# Altium schematic sheet 5VSupply_3.5A.SchDoc
size A; SheetNumber: 2; SheetTotal: 3
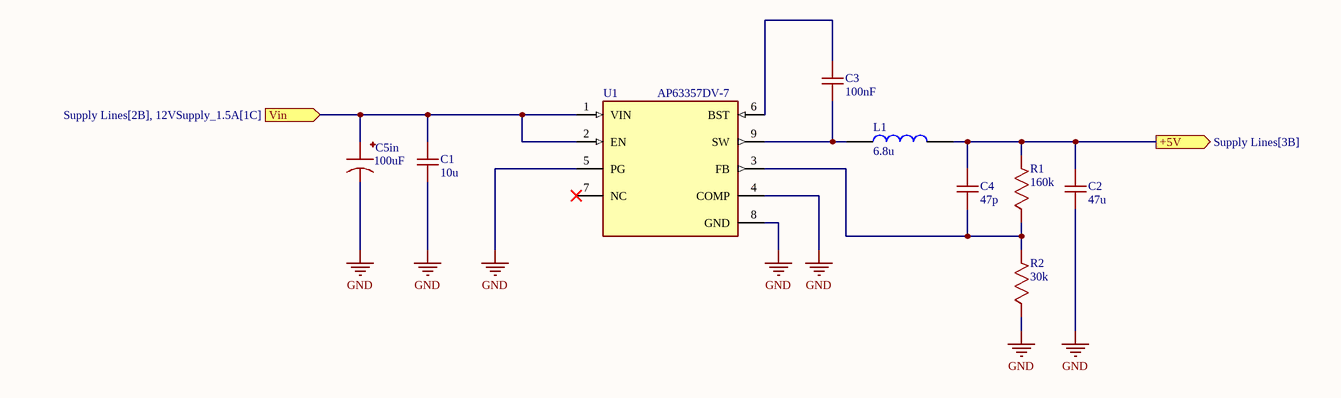
[diagram p0: 5VSupply_3.5A.SchDoc]

## Parts
C1  10u  [FP-GRM21B-0_15-IPC_A]
C2  47u  [FP-GRM21B-0_15-IPC_A]
C3  100nF  [CAPC2013X140X45ML15T25]
C4  47p  [(KEMET 0805) FP-C0805C-DN-IPC_A - duplicate]
C5in  100uF  [CAPPRD350W60D800H1150]
L1  6.8u  [INDPM7366X300N]
R1  160k  [RESC2013X60X40LL20T25]
R2  30k  [FP-CRGCQ0805-IPC_A - duplicate]
U1  AP63357DV-7  [CONV_AP63357DV-7]

## Ports
+5V (out, see Supply Lines[3B]), Vin (in, see Supply Lines[2B], 12VSupply_1.5A[1C])

## Nets
GND: C1.1 C2.1 C5in.2 R2.1 U1.4(COMP) U1.5(PG) U1.8(GND)
+5V: C2.2 C4.2 L1.2 R1.2 ; port +5V
Vin: C1.2 C5in.1 U1.1(VIN) U1.2(EN) ; port Vin
NetC3_1: C3.1 L1.1 U1.9(SW)
NetC3_2: C3.2 U1.6(BST)
NetC4_1: C4.1 R1.1 R2.2 U1.3(FB)

Not connected (* = marked no-connect by the designer): U1 7(NC)*

## Library data of the parts
C1 = GRM21BC81E106KE51L: Ceramic Capacitor, Ceramic, 25V, 10% +Tol, 10% -Tol, X6S, 22% TC, 10uF, Surface Mount, 0805; Manufacturer: Murata; Manufacturer Lifecycle Status: IN PRODUCTION; Value: 10µF; Supplier: DigiKey; Supplier Part Number: 490-10502-1-ND; Manufacturer Part Number: GRM21BC81E106KE51L; RoHS: Compliant; Category: Ceramic Capacitors; Stock: 699194; Pricing: 1=0.23, 10=0.133, 50=0.0956, 100=0.0841, 500=0.06476, 1000=0.05881 (USD); Case/Package: 0805; Case Code (Imperial): 0805; Case Code (Metric): 2012; Dielectric: X6S; Dielectric Material: Ceramic; Height: 1.25mm; Length: 2mm; Lifecycle Status: Production; Material: Ceramic; Max Operating Temperature: 105°C; Min Operating Temperature: -55°C; Mounting Technology: Surface Mount; Number of Terminals: 2; REACH SVHC: Yes; Schedule B: 8532240020, 8532240020|8532240020|8532240020|8532240020|8532240020|8532240020|8532240020|8532240020|8532240020|8532240020|8532240020|8532240020|8532240020|8532240020|8532240020|8532240020|8532240020|8532240020|8532240020|8532240020|8532240020|8532240020|8532240020|85; Thickness: 1.25mm; Tolerance: 10%; Voltage Rating: 25V; Voltage Rating (DC): 25V; Width: 1.25mm; ComponentLink1URL: https://datasheet.octopart.com:443/GRM21BC81E106KE51L-Murata-datasheet-155239200.pdf?src-supplier=Newark; ComponentLink1Description: https://datasheet.octopart.com:443/GRM21BC81E106KE51L-Murata-datasheet-155239200.pdf?src-supplier=Newark; ComponentLink2URL: https://datasheet.octopart.com:443/GRM21BC81E106KE51L-Murata-datasheet-178521784.pdf?src-supplier=Arrow.cn; ComponentLink2Description: https://datasheet.octopart.com:443/GRM21BC81E106KE51L-Murata-datasheet-178521784.pdf?src-supplier=Arrow.cn; ComponentLink3URL: https://datasheet.octopart.com:443/GRM21BC81E106KE51L-Murata-datasheet-165579666.pdf?src-supplier=TME; ComponentLink3Description: https://datasheet.octopart.com:443/GRM21BC81E106KE51L-Murata-datasheet-165579666.pdf?src-supplier=TME; ComponentLink4URL: https://datasheet.octopart.com:443/GRM21BC81E106KE51L-Murata-datasheet-140707432.pdf?src-supplier=Ciiva; ComponentLink4Description: https://datasheet.octopart.com:443/GRM21BC81E106KE51L-Murata-datasheet-140707432.pdf?src-supplier=Ciiva; ComponentLink5URL: https://datasheet.octopart.com:443/GRM21BC81E106KE51L-Murata-datasheet-140706587.pdf?src-supplier=Ciiva; ComponentLink5Description: https://datasheet.octopart.com:443/GRM21BC81E106KE51L-Murata-datasheet-140706587.pdf?src-supplier=Ciiva; ComponentLink6URL: https://datasheet.octopart.com:443/GRM21BC81E106KE51L-Murata-datasheet-138744753.pdf?src-supplier=Ciiva; ComponentLink6Description: https://datasheet.octopart.com:443/GRM21BC81E106KE51L-Murata-datasheet-138744753.pdf?src-supplier=Ciiva; ComponentLink7URL: https://datasheet.octopart.com:443/GRM21BC81E106KE51L-Murata-datasheet-32479577.pdf?src-supplier=Future+Electronics; ComponentLink7Description: https://datasheet.octopart.com:443/GRM21BC81E106KE51L-Murata-datasheet-32479577.pdf?src-supplier=Future+Electronics; ComponentLink8URL: https://datasheet.octopart.com/GRM21BC81E106KE51L-Murata-datasheet-12515295.pdf; ComponentLink8Description: https://datasheet.octopart.com/GRM21BC81E106KE51L-Murata-datasheet-12515295.pdf; ComponentLink9URL: https://datasheet.octopart.com/GRM21BC81E106KE51L-Murata-datasheet-12510076.pdf; ComponentLink9Description: https://datasheet.octopart.com/GRM21BC81E106KE51L-Murata-datasheet-12510076.pdf; ComponentLink10URL: https://datasheet.octopart.com/GRM21BC81E106KE51L-Murata-datasheet-11978611.pdf; ComponentLink10Description: https://datasheet.octopart.com/GRM21BC81E106KE51L-Murata-datasheet-11978611.pdf; ComponentLink11URL: https://datasheet.octopart.com/GRM21BC81E106KE51L-Murata-datasheet-10025737.pdf; ComponentLink11Description: https://datasheet.octopart.com/GRM21BC81E106KE51L-Murata-datasheet-10025737.pdf; ComponentLink12URL: https://datasheet.octopart.com/GRM21BC81E106KE51L-Murata-datasheet-8819587.pdf; ComponentLink12Description: https://datasheet.octopart.com/GRM21BC81E106KE51L-Murata-datasheet-8819587.pdf; ComponentLink13URL: https://datasheet.octopart.com/GRM21BC81E106KE51L-Murata-datasheet-38883375.pdf; ComponentLink13Description: https://datasheet.octopart.com/GRM21BC81E106KE51L-Murata-datasheet-38883375.pdf; ComponentLink14URL: http://sigma.octopart.com:80/reach_statement/Murata-company-16.pdf?src-supplier=Compliance+Statements; ComponentLink14Description: http://sigma.octopart.com:80/reach_statement/Murata-company-16.pdf?src-supplier=Compliance+Statements
C2 = GRM21BR61A476ME15L: 10V 47uF X5R ±20% 0805 Multilayer Ceramic Capacitors MLCC - SMD/SMT ROHS; Manufacturer: Murata; Manufacturer Lifecycle Status: IN PRODUCTION; Value: 47µF; Dissipation Factor: 0.035%; Supplier: Mouser; Supplier Part Number: 81-GRM21BR61A476ME5L; Manufacturer Part Number: GRM21BR61A476ME15L; RoHS: Compliant; Category: Ceramic Capacitors; Stock: 454455; Pricing: 1=0.64, 10=0.423, 50=0.285, 100=0.264, 500=0.213, 1000=0.195, 3000=0.152, 6000=0.147, 10000=0.17 (USD); Case/Package: 0805; Case Code (Imperial): 0805; Case Code (Metric): 2012; Country of Origin: Philippines; Depth: 1.25mm; Dielectric: X5R; Dielectric Material: Ceramic; Export Control Classification Number (ECCN) Code: EAR99; Height: 1.25mm; Harmonized Tariff Schedule (HTS) Code: 8532.24.00.20; Introduction Date: 2013-11-20; Lead Free: Lead Free; Length: 2mm; Lifecycle Status: Production; Material: Ceramic; Max Operating Temperature: 85°C; Min Operating Temperature: -55°C; Mounting Technology: Surface Mount; Number of Terminals: 2; Packaging: Cut Tape; REACH SVHC: Yes; Schedule B: 8532240020, 8532240020|8532240020, 8532240020|8532240020|8532240020, 8532240020|8532240020|8532240020|8532240020; Termination: SMD/SMT; Thickness: 1.25mm; Tolerance: 20%; Voltage: 10V; Voltage Rating: 10V; Voltage Rating (DC): 10V; Width: 1.25mm; ComponentLink1URL: https://datasheet.octopart.com:443/GRM21BR61A476ME15L-Murata-datasheet-22122223.pdf?src-supplier=Upverter; ComponentLink1Description: https://datasheet.octopart.com:443/GRM21BR61A476ME15L-Murata-datasheet-22122223.pdf?src-supplier=Upverter; ComponentLink2URL: https://datasheet.octopart.com:443/GRM21BR61A476ME15L-Murata-datasheet-66077109.pdf?src-supplier=element14+APAC; ComponentLink2Description: https://datasheet.octopart.com:443/GRM21BR61A476ME15L-Murata-datasheet-66077109.pdf?src-supplier=element14+APAC; ComponentLink3URL: https://datasheet.octopart.com:443/GRM21BR61A476ME15L-Murata-datasheet-141278181.pdf?src-supplier=Geoflip; ComponentLink3Description: https://datasheet.octopart.com:443/GRM21BR61A476ME15L-Murata-datasheet-141278181.pdf?src-supplier=Geoflip; ComponentLink4URL: https://datasheet.octopart.com:443/GRM21BR61A476ME15L-Murata-datasheet-165579666.pdf?src-supplier=TME; ComponentLink4Description: https://datasheet.octopart.com:443/GRM21BR61A476ME15L-Murata-datasheet-165579666.pdf?src-supplier=TME; ComponentLink5URL: https://datasheet.octopart.com:443/GRM21BR61A476ME15L-Murata-datasheet-59876780.pdf?src-supplier=TME; ComponentLink5Description: https://datasheet.octopart.com:443/GRM21BR61A476ME15L-Murata-datasheet-59876780.pdf?src-supplier=TME; ComponentLink6URL: https://datasheet.octopart.com:443/GRM21BR61A476ME15L-Murata-datasheet-140707527.pdf?src-supplier=Ciiva; ComponentLink6Description: https://datasheet.octopart.com:443/GRM21BR61A476ME15L-Murata-datasheet-140707527.pdf?src-supplier=Ciiva; ComponentLink7URL: https://datasheet.octopart.com:443/GRM21BR61A476ME15L-Murata-datasheet-138744839.pdf?src-supplier=Ciiva; ComponentLink7Description: https://datasheet.octopart.com:443/GRM21BR61A476ME15L-Murata-datasheet-138744839.pdf?src-supplier=Ciiva; ComponentLink8URL: https://datasheet.octopart.com/GRM21BR61A476ME15L-Murata-datasheet-12515295.pdf; ComponentLink8Description: https://datasheet.octopart.com/GRM21BR61A476ME15L-Murata-datasheet-12515295.pdf; ComponentLink9URL: https://datasheet.octopart.com/GRM21BR61A476ME15L-Murata-datasheet-12510076.pdf; ComponentLink9Description: https://datasheet.octopart.com/GRM21BR61A476ME15L-Murata-datasheet-12510076.pdf; ComponentLink10URL: https://datasheet.octopart.com/GRM21BR61A476ME15L-Murata-datasheet-11978611.pdf; ComponentLink10Description: https://datasheet.octopart.com/GRM21BR61A476ME15L-Murata-datasheet-11978611.pdf; ComponentLink11URL: https://datasheet.octopart.com/GRM21BR61A476ME15L-Murata-datasheet-10025737.pdf; ComponentLink11Description: https://datasheet.octopart.com/GRM21BR61A476ME15L-Murata-datasheet-10025737.pdf; ComponentLink12URL: https://datasheet.octopart.com/GRM21BR61A476ME15L-Murata-datasheet-8819587.pdf; ComponentLink12Description: https://datasheet.octopart.com/GRM21BR61A476ME15L-Murata-datasheet-8819587.pdf; ComponentLink13URL: http://sigma.octopart.com:80/reach_statement/Murata-company-16.pdf?src-supplier=Compliance+Statements; ComponentLink13Description: http://sigma.octopart.com:80/reach_statement/Murata-company-16.pdf?src-supplier=Compliance+Statements
C3 = GCM21BR71E104KA37L: Ceramic Capacitor, Ceramic, 25V, 10% +Tol, 10% -Tol, X7R, 15% TC, 0.1uF, Surface Mount, 0805; Manufacturer: Murata; Manufacturer Lifecycle Status: NRND; Supplier: DigiKey; Supplier Part Number: 490-14779-1-ND; Manufacturer Part Number: GCM21BR71E104KA37L; RoHS: Compliant; Category: Ceramic Capacitors; Stock: 12316; Pricing: 1=0.35, 10=0.208, 50=0.1528, 100=0.1358, 500=0.10726, 1000=0.09846 (USD); Value: 100nF; Case/Package: 0805; Case Code (Imperial): 0805; Case Code (Metric): 2012; Depth: 1.25mm; Dielectric: X7R; Dielectric Material: Ceramic; Height: 1.25mm; Length: 2mm; Lifecycle Status: NRND; Max Operating Temperature: 125°C; Min Operating Temperature: -55°C; Mounting Technology: Surface Mount; Number of Terminals: 2; Radiation Hardening: No; Ratings: AEC-Q200; REACH SVHC: Yes; Schedule B: 8532240020, 8532240020|8532240020|8532240020|8532240020|8532240020; Termination: SMD/SMT; Tolerance: 10%; Voltage Rating: 25V; Voltage Rating (DC): 25V; Width: 1.25mm; ComponentLink1URL: https://datasheet.octopart.com:443/GCM21BR71E104KA37L-Murata-datasheet-141268656.pdf?src-supplier=Geoflip; ComponentLink1Description: https://datasheet.octopart.com:443/GCM21BR71E104KA37L-Murata-datasheet-141268656.pdf?src-supplier=Geoflip; ComponentLink2URL: https://datasheet.octopart.com:443/GCM21BR71E104KA37L-Murata-datasheet-140660253.pdf?src-supplier=Ciiva; ComponentLink2Description: https://datasheet.octopart.com:443/GCM21BR71E104KA37L-Murata-datasheet-140660253.pdf?src-supplier=Ciiva; ComponentLink3URL: https://datasheet.octopart.com:443/GCM21BR71E104KA37L-Murata-datasheet-138719617.pdf?src-supplier=Ciiva; ComponentLink3Description: https://datasheet.octopart.com:443/GCM21BR71E104KA37L-Murata-datasheet-138719617.pdf?src-supplier=Ciiva; ComponentLink4URL: https://datasheet.octopart.com:443/GCM21BR71E104KA37L-Murata-datasheet-128592896.pdf?src-supplier=X-ON; ComponentLink4Description: https://datasheet.octopart.com:443/GCM21BR71E104KA37L-Murata-datasheet-128592896.pdf?src-supplier=X-ON; ComponentLink5URL: https://datasheet.octopart.com/GCM21BR71E104KA37L-Murata-datasheet-14404970.pdf; ComponentLink5Description: https://datasheet.octopart.com/GCM21BR71E104KA37L-Murata-datasheet-14404970.pdf; ComponentLink6URL: http://sigma.octopart.com:80/reach_statement/Murata-company-16.pdf?src-supplier=Compliance+Statements; ComponentLink6Description: http://sigma.octopart.com:80/reach_statement/Murata-company-16.pdf?src-supplier=Compliance+Statements
C4 = C0805C470J5GACTU: 50V 47pF C0G ±5% 0805 Multilayer Ceramic Capacitors MLCC - SMD/SMT ROHS; Manufacturer: KEMET; Dissipation Factor: 0.1%; Temperature Coefficient: 30ppm/°C; Supplier: DigiKey; Supplier Part Number: 399-C0805C470J5GACTUCT-ND; Manufacturer Part Number: C0805C470J5GACTU; RoHS: Compliant; Category: Ceramic Capacitors; Stock: 124597; Pricing: 1=0.1, 10=0.049, 50=0.0334, 100=0.0287, 500=0.02092, 1000=0.01854 (USD); Value: 47pF; Case/Package: 0805; Case Code (Imperial): 0805; China RoHS: Compliant; Contact Material: Tin; Depth: 1.25mm; Dielectric Material: Ceramic; Height: 780µm; Lead Free: Lead Free; Lead Pitch: 750µm; Length: 2mm; Lifecycle Status: Production; Material: Ceramic; Max Operating Temperature: 125°C; Min Operating Temperature: -55°C; Mounting Technology: Surface Mount; Pins: 2; Number of Terminals: 2; Packaging: Cut Tape; Radiation Hardening: No; REACH SVHC: Yes; Schedule B: 8532240020, 8532240020|8532240020|8532240020|8532240020|8532240020, 8532240020|8532240020|8532240020|8532240020|8532240020|8532240020|8532240020|8532240020|8532240020, 8532240020|8532240020|8532240020|8532240020|8532240020|8532240020|8532240020|8532240020|8532240020|8532240020; Termination: SMD/SMT; Thickness: 889µm; Tolerance: 5%; Voltage: 50V; Voltage Rating: 50V; Voltage Rating (DC): 50V; Width: 1.25mm; ComponentLink1URL: https://datasheet.octopart.com:443/C0805C470J5GACTU-KEMET-datasheet-178132257.pdf?src-supplier=IHS; ComponentLink1Description: https://datasheet.octopart.com:443/C0805C470J5GACTU-KEMET-datasheet-178132257.pdf?src-supplier=IHS; ComponentLink2URL: https://datasheet.octopart.com:443/C0805C470J5GAC7800-KEMET-datasheet-182042351.pdf?src-supplier=IHS; ComponentLink2Description: https://datasheet.octopart.com:443/C0805C470J5GAC7800-KEMET-datasheet-182042351.pdf?src-supplier=IHS; ComponentLink3URL: https://datasheet.octopart.com:443/C0805C470J5GACTU-KEMET-datasheet-68331921.pdf?src-supplier=Upverter; ComponentLink3Description: https://datasheet.octopart.com:443/C0805C470J5GACTU-KEMET-datasheet-68331921.pdf?src-supplier=Upverter; ComponentLink4URL: https://datasheet.octopart.com:443/C0805C470J5GACTU-Kemet-datasheet-5314449.pdf?src-supplier=Newark; ComponentLink4Description: https://datasheet.octopart.com:443/C0805C470J5GACTU-Kemet-datasheet-5314449.pdf?src-supplier=Newark; ComponentLink5URL: https://datasheet.octopart.com:443/C0805C470J5GACTU-Kemet-datasheet-10282724.pdf?src-supplier=Newark; ComponentLink5Description: https://datasheet.octopart.com:443/C0805C470J5GACTU-Kemet-datasheet-10282724.pdf?src-supplier=Newark; ComponentLink6URL: https://datasheet.octopart.com:443/C0805C470J5GACTU-KEMET-datasheet-170667471.pdf?src-supplier=Newark; ComponentLink6Description: https://datasheet.octopart.com:443/C0805C470J5GACTU-KEMET-datasheet-170667471.pdf?src-supplier=Newark; ComponentLink7URL: https://datasheet.octopart.com:443/C0805C470J5GACTU-KEMET-datasheet-149524325.pdf?src-supplier=Farnell; ComponentLink7Description: https://datasheet.octopart.com:443/C0805C470J5GACTU-KEMET-datasheet-149524325.pdf?src-supplier=Farnell; ComponentLink8URL: https://datasheet.octopart.com:443/C0805C470J5GACTU-KEMET-datasheet-101576292.pdf?src-supplier=Farnell; ComponentLink8Description: https://datasheet.octopart.com:443/C0805C470J5GACTU-KEMET-datasheet-101576292.pdf?src-supplier=Farnell; ComponentLink9URL: https://datasheet.octopart.com:443/C0805C470J5GACTU-Kemet-datasheet-10540709.pdf?src-supplier=Farnell; ComponentLink9Description: https://datasheet.octopart.com:443/C0805C470J5GACTU-Kemet-datasheet-10540709.pdf?src-supplier=Farnell; ComponentLink10URL: https://datasheet.octopart.com:443/C0805C470J5GACTU-KEMET-datasheet-178088151.pdf?src-supplier=element14+APAC; ComponentLink10Description: https://datasheet.octopart.com:443/C0805C470J5GACTU-KEMET-datasheet-178088151.pdf?src-supplier=element14+APAC; ComponentLink11URL: https://datasheet.octopart.com:443/C0805C470J5GACTU-KEMET-datasheet-178088150.pdf?src-supplier=element14+APAC; ComponentLink11Description: https://datasheet.octopart.com:443/C0805C470J5GACTU-KEMET-datasheet-178088150.pdf?src-supplier=element14+APAC; ComponentLink12URL: https://datasheet.octopart.com:443/C0805C470J5GACTU-Kemet-datasheet-22084244.pdf?src-supplier=element14+APAC; ComponentLink12Description: https://datasheet.octopart.com:443/C0805C470J5GACTU-Kemet-datasheet-22084244.pdf?src-supplier=element14+APAC; ComponentLink13URL: https://datasheet.octopart.com:443/C0805C470J5GACTU-Kemet-datasheet-48876295.pdf?src-supplier=element14+APAC; ComponentLink13Description: https://datasheet.octopart.com:443/C0805C470J5GACTU-Kemet-datasheet-48876295.pdf?src-supplier=element14+APAC; ComponentLink14URL: https://datasheet.octopart.com:443/C0805C470J5GACTU-KEMET-datasheet-37178240.pdf?src-supplier=Electro+Sonic; ComponentLink14Description: https://datasheet.octopart.com:443/C0805C470J5GACTU-KEMET-datasheet-37178240.pdf?src-supplier=Electro+Sonic; ComponentLink15URL: https://datasheet.octopart.com:443/C0805C470J5GACTU-Kemet-datasheet-68096432.pdf?src-supplier=TME; ComponentLink15Description: https://datasheet.octopart.com:443/C0805C470J5GACTU-Kemet-datasheet-68096432.pdf?src-supplier=TME; ComponentLink16URL: https://datasheet.octopart.com/C0805C470J5GACTU-KEMET-datasheet-84169754.pdf; ComponentLink16Description: https://datasheet.octopart.com/C0805C470J5GACTU-KEMET-datasheet-84169754.pdf; ComponentLink17URL: https://datasheet.octopart.com:443/C0805C470J5GACTU-Kemet-datasheet-11967729.pdf?src-supplier=Arrow+Electronics; ComponentLink17Description: https://datasheet.octopart.com:443/C0805C470J5GACTU-Kemet-datasheet-11967729.pdf?src-supplier=Arrow+Electronics; ComponentLink18URL: https://datasheet.octopart.com:443/C0805C470J5GAC7800-KEMET-datasheet-164857143.pdf?src-supplier=Burklin+Elektronik; ComponentLink18Description: https://datasheet.octopart.com:443/C0805C470J5GAC7800-KEMET-datasheet-164857143.pdf?src-supplier=Burklin+Elektronik; ComponentLink19URL: https://datasheet.octopart.com:443/C0805C470J5GAC-TU-Kemet-datasheet-7589841.pdf?src-supplier=Jameco; ComponentLink19Description: https://datasheet.octopart.com:443/C0805C470J5GAC-TU-Kemet-datasheet-7589841.pdf?src-supplier=Jameco; ComponentLink20URL: https://datasheet.octopart.com:443/C0805C470J5GACTU-Kemet-datasheet-464.pdf?src-supplier=RS+(Formerly+Allied+Electronics); ComponentLink20Description: https://datasheet.octopart.com:443/C0805C470J5GACTU-Kemet-datasheet-464.pdf?src-supplier=RS+(Formerly+Allied+Electronics)
C5in = EEU-FR1V101B: FR ALUMINUM ELECTROLYTIC CAPACITOR Radial Can aluminum electrolytic capacitor 0.315Dia 8.00mm ±20% 100muF 35V; Manufacturer: Panasonic; Value: 100µF; Lead Diameter: 600µm; Life (Hours): 6000hours; Ripple Current: 950mA; Supplier: DigiKey; Supplier Part Number: P124226CT-ND; Manufacturer Part Number: EEU-FR1V101B; RoHS: Compliant; Category: Aluminum Electrolytic Capacitors; Stock: 15444; Pricing: 1=0.61, 10=0.383, 50=0.2852, 100=0.2542, 500=0.20076 (USD); Case/Package: Radial; Contact Plating: Tin; Diameter: 8mm; Lead Pitch: 5mm; Max Operating Temperature: 105°C; Min Operating Temperature: -40°C; Mounting Technology: Through Hole; Schedule B: 8532220020, 8532220020|8532220020, 8532220020|8532220020|8532220020, 8532220020|8532220020|8532220020|8532220020; Termination: Radial; Tolerance: 20%; ComponentLink1URL: https://datasheet.octopart.com:443/EEU-FR1V101B-Panasonic-datasheet-62330550.pdf?src-supplier=Electro+Sonic; ComponentLink1Description: https://datasheet.octopart.com:443/EEU-FR1V101B-Panasonic-datasheet-62330550.pdf?src-supplier=Electro+Sonic
L1 = BMRA000606306R8MA1: Inductor Power Molded/Shielded Wirewound 6.8uH 20% 100kHz 4.5A SMD T/R; Manufacturer: Pulse Electronics; Core Material: Composite; DC Resistance (DCR): 60mΩ; Value: 6.8µH; Number of Circuits: 1; Supplier: Mouser; Supplier Part Number: 603-BMRA0606306R8MA1; Manufacturer Part Number: BMRA000606306R8MA1; RoHS: Compliant; Category: Fixed Inductors; Stock: 20018; Pricing: 1=0.39, 10=0.318, 50=0.318, 100=0.262, 1000=0.211, 10000=0.187 (USD); Country of Origin: Mainland China, Taiwan; Export Control Classification Number (ECCN) Code: EAR99; Height: 3mm; Harmonized Tariff Schedule (HTS) Code: 8504.50.80.00; Introduction Date: 2021-03-29; Lifecycle Status: Production; Max Current Rating: 4.5A; Max Operating Temperature: 125°C; Min Operating Temperature: -55°C; Number of Terminals: 2; REACH SVHC: Yes; Shielding: Shielded; Test Frequency: 100kHz; Tolerance: 20%; Width: 6.6mm; ComponentLink1URL: https://datasheet.octopart.com:443/BMRA000606306R8MA1-Pulse-datasheet-180094538.pdf?src-supplier=IHS; ComponentLink1Description: https://datasheet.octopart.com:443/BMRA000606306R8MA1-Pulse-datasheet-180094538.pdf?src-supplier=IHS; ComponentLink2URL: https://datasheet.octopart.com:443/BMRA000606306R8MA1-Pulse-datasheet-155427411.pdf?src-supplier=IHS; ComponentLink2Description: https://datasheet.octopart.com:443/BMRA000606306R8MA1-Pulse-datasheet-155427411.pdf?src-supplier=IHS
R1 = ERA6AEB164V: Res Thin Film 0805 160K Ohm 0.1% 0.125W ±25ppm/°C Molded SMD Punched Carrier T/R; Manufacturer: Panasonic; Manufacturer Lifecycle Status: ACTIVE; Part Series: Thin Film Chip Resistors, High Reliability Type; Max Power Dissipation: 125mW; Value: 160kΩ; Voltage Rating: 100V; Supplier: Mouser; Supplier Part Number: 667-ERA-6AEB164V; Manufacturer Part Number: ERA6AEB164V; RoHS: Compliant; Category: Chip SMD Resistors; Stock: 9105; Pricing: 1=0.1, 10=0.054, 50=0.054, 100=0.051, 1000=0.042, 10000=0.035 (USD); Case/Package: 0805; Case Code (Imperial): 0805; China RoHS: Non-Compliant; Composition: Thin Film; Contact Plating: Tin; Depth: 1.25mm; Features: Automotive AEC-Q200; Height: 500µm; Lead Free: Lead Free; Length: 2mm; Lifecycle Status: Production; Max Operating Temperature: 155°C; Military Standard: Not; Min Operating Temperature: -55°C; Mounting Technology: Surface Mount; Pins: 2; Number of Terminals: 2; Number of Terminations: 2; Packaging: Cut Tape; Power Dissipation: 125mW; Power Rating: 125mW; Radiation Hardening: No; REACH SVHC: Yes; Schedule B: 8533210045, 8533210045|8533210045|8533210045|8533210045|8533210045; Temperature Coefficient: 25ppm/°C; Termination: SMD/SMT; Tolerance: 0.1%; Voltage Rating (DC): 100V; Weight: 5.499807mg; Width: 1.25mm; Working Voltage: 100V; ComponentLink1URL: https://datasheet.octopart.com:443/ERA6AEB164V-Panasonic-datasheet-181959660.pdf?src-supplier=IHS; ComponentLink1Description: https://datasheet.octopart.com:443/ERA6AEB164V-Panasonic-datasheet-181959660.pdf?src-supplier=IHS; ComponentLink2URL: https://datasheet.octopart.com/ERA6AEB164V-Panasonic-datasheet-62287448.pdf; ComponentLink2Description: https://datasheet.octopart.com/ERA6AEB164V-Panasonic-datasheet-62287448.pdf; ComponentLink3URL: https://datasheet.octopart.com/ERA6AEB164V-Panasonic-datasheet-78375410.pdf; ComponentLink3Description: https://datasheet.octopart.com/ERA6AEB164V-Panasonic-datasheet-78375410.pdf; ComponentLink4URL: https://datasheet.octopart.com:443/ERA6AEB164V-Panasonic-datasheet-136531316.pdf?src-supplier=Newark; ComponentLink4Description: https://datasheet.octopart.com:443/ERA6AEB164V-Panasonic-datasheet-136531316.pdf?src-supplier=Newark; ComponentLink5URL: https://datasheet.octopart.com:443/ERA6AEB164V-Panasonic-datasheet-8367715.pdf?src-supplier=Newark; ComponentLink5Description: https://datasheet.octopart.com:443/ERA6AEB164V-Panasonic-datasheet-8367715.pdf?src-supplier=Newark; ComponentLink6URL: https://datasheet.octopart.com:443/ERA-6AEB164V-Panasonic-datasheet-154766165.pdf?src-supplier=JRH+Electronics; ComponentLink6Description: https://datasheet.octopart.com:443/ERA-6AEB164V-Panasonic-datasheet-154766165.pdf?src-supplier=JRH+Electronics; ComponentLink7URL: https://datasheet.octopart.com:443/ERA-6AEB164V-Panasonic-datasheet-118567.pdf?src-supplier=element14; ComponentLink7Description: https://datasheet.octopart.com:443/ERA-6AEB164V-Panasonic-datasheet-118567.pdf?src-supplier=element14; ComponentLink8URL: https://datasheet.octopart.com:443/ERA6AEB164V-Panasonic-datasheet-61114971.pdf?src-supplier=element14+APAC; ComponentLink8Description: https://datasheet.octopart.com:443/ERA6AEB164V-Panasonic-datasheet-61114971.pdf?src-supplier=element14+APAC; ComponentLink9URL: https://datasheet.octopart.com:443/ERA6AEB164V-Panasonic-datasheet-188913046.pdf?src-supplier=TME; ComponentLink9Description: https://datasheet.octopart.com:443/ERA6AEB164V-Panasonic-datasheet-188913046.pdf?src-supplier=TME; ComponentLink10URL: https://sigma.octopart.com:443/150570796/technical_drawing/Panasonic-ERA6AEB164V.pdf?src-supplier=Panasonic+SCT; ComponentLink10Description: https://sigma.octopart.com:443/150570796/technical_drawing/Panasonic-ERA6AEB164V.pdf?src-supplier=Panasonic+SCT; ComponentLink11URL: https://datasheet.octopart.com:443/ERA6AEB164V-Panasonic-datasheet-138783076.pdf?src-supplier=Burklin+Elektronik; ComponentLink11Description: https://datasheet.octopart.com:443/ERA6AEB164V-Panasonic-datasheet-138783076.pdf?src-supplier=Burklin+Elektronik; ComponentLink12URL: https://datasheet.octopart.com:443/ERA6AEB164V-Panasonic---ECG-datasheet-15994758.pdf?src-supplier=Farnell; ComponentLink12Description: https://datasheet.octopart.com:443/ERA6AEB164V-Panasonic---ECG-datasheet-15994758.pdf?src-supplier=Farnell; ComponentLink13URL: https://datasheet.octopart.com:443/ERA-6AEB164V-Panasonic-datasheet-13266200.pdf?src-supplier=Electro+Sonic; ComponentLink13Description: https://datasheet.octopart.com:443/ERA-6AEB164V-Panasonic-datasheet-13266200.pdf?src-supplier=Electro+Sonic; ComponentLink14URL: https://datasheet.octopart.com:443/ERA-6AEB164V-Panasonic-datasheet-33006989.pdf?src-supplier=Electro+Sonic; ComponentLink14Description: https://datasheet.octopart.com:443/ERA-6AEB164V-Panasonic-datasheet-33006989.pdf?src-supplier=Electro+Sonic; ComponentLink15URL: https://datasheet.octopart.com:443/ERA-6AEB164V-Panasonic-datasheet-46744048.pdf?src-supplier=Electro+Sonic; ComponentLink15Description: https://datasheet.octopart.com:443/ERA-6AEB164V-Panasonic-datasheet-46744048.pdf?src-supplier=Electro+Sonic
R2 = CRG0805F30K: Res Thick Film 0805 30K Ohm 1% 0.125W(1/8W) ±100ppm/C Pad SMD T/R; Manufacturer: TE Connectivity; Manufacturer Lifecycle Status: ACTIVE; Max Power Dissipation: 125mW; Number of Resistors: 1; Operating Supply Voltage: 150V; Value: 30kΩ; Temperature Coefficient: 100ppm/°C; Supplier: Mouser; Supplier Part Number: 279-CRG0805F30K; Manufacturer Part Number: CRG0805F30K; RoHS: Compliant; Category: Chip SMD Resistors; Stock: 24302; Pricing: 1=0.1, 10=0.023, 50=0.023, 100=0.019, 1000=0.011, 10000=0.006 (USD); Case/Package: 0805; Case Code (Imperial): 0805; Case Code (Metric): 2012; China RoHS: Non-Compliant; Composition: Thick Film; Depth: 1.25mm; Export Control Classification Number (ECCN) Code: EAR99; ELV: Compliant; Height: 550µm; Harmonized Tariff Schedule (HTS) Code: 8533.21.00.30; Introduction Date: 2009-09-24; Length: 2mm; Lifecycle Status: Production; Max Operating Temperature: 155°C; Military Standard: Not; Min Operating Temperature: -55°C; Mounting Technology: Surface Mount; Number of Terminals: 2; Number of Terminations: 2; Packaging: Tape & Reel (TR); Power Dissipation: 125mW; Power Rating: 125mW; Radiation Hardening: No; REACH SVHC: Yes; Termination: Solder; Tolerance: 1%; Voltage Rating: 150V; Weight: 5.499807mg; Width: 1.25mm; Working Voltage: 150V; ComponentLink1URL: https://datasheet.octopart.com:443/CRG0805F30K-TE-Connectivity-datasheet-167977698.pdf?src-supplier=Future+Electronics; ComponentLink1Description: https://datasheet.octopart.com:443/CRG0805F30K-TE-Connectivity-datasheet-167977698.pdf?src-supplier=Future+Electronics; ComponentLink2URL: https://datasheet.octopart.com:443/CRG0805F30K-TE-Connectivity-datasheet-44624597.pdf?src-supplier=Farnell; ComponentLink2Description: https://datasheet.octopart.com:443/CRG0805F30K-TE-Connectivity-datasheet-44624597.pdf?src-supplier=Farnell; ComponentLink3URL: https://datasheet.octopart.com:443/CRG0805F30K-TE-Connectivity-datasheet-11120284.pdf?src-supplier=Farnell; ComponentLink3Description: https://datasheet.octopart.com:443/CRG0805F30K-TE-Connectivity-datasheet-11120284.pdf?src-supplier=Farnell; ComponentLink4URL: https://datasheet.octopart.com:443/CRG0805F30K-TE-Connectivity-datasheet-128558484.pdf?src-supplier=Master+Electronics; ComponentLink4Description: https://datasheet.octopart.com:443/CRG0805F30K-TE-Connectivity-datasheet-128558484.pdf?src-supplier=Master+Electronics; ComponentLink5URL: https://datasheet.octopart.com:443/1623191-1-TE-Connectivity---AMP-datasheet-189108518.pdf?src-supplier=Master+Electronics; ComponentLink5Description: https://datasheet.octopart.com:443/1623191-1-TE-Connectivity---AMP-datasheet-189108518.pdf?src-supplier=Master+Electronics; ComponentLink6URL: https://datasheet.octopart.com:443/CRG0805F30K-Tyco-Electronics-datasheet-11120141.pdf?src-supplier=TE+Connectivity; ComponentLink6Description: https://datasheet.octopart.com:443/CRG0805F30K-Tyco-Electronics-datasheet-11120141.pdf?src-supplier=TE+Connectivity; ComponentLink7URL: https://sigma.octopart.com:443/14528497/technical_drawing/TE-Connectivity-CRG0805F30K.pdf?src-supplier=Sager+Electronics; ComponentLink7Description: https://sigma.octopart.com:443/14528497/technical_drawing/TE-Connectivity-CRG0805F30K.pdf?src-supplier=Sager+Electronics; ComponentLink8URL: https://datasheet.octopart.com:443/CRG0805F30K-TE-Connectivity-datasheet-137111068.pdf?src-supplier=X-ON; ComponentLink8Description: https://datasheet.octopart.com:443/CRG0805F30K-TE-Connectivity-datasheet-137111068.pdf?src-supplier=X-ON; ComponentLink9URL: http://sigma.octopart.com:80/14528496/rohs_certificate/TE-Connectivity-CRG0805F30K.pdf?src-supplier=Compliance+Statements; ComponentLink9Description: http://sigma.octopart.com:80/14528496/rohs_certificate/TE-Connectivity-CRG0805F30K.pdf?src-supplier=Compliance+Statements
U1 = AP63357DV-7: DC-DC Switching Synchronous Buck Regulator, Adjustable, 3.8V-32V in, 0.8-31V/3.5A out, V-DFN3020-13; Manufacturer: Diodes Inc.; Max Supply Voltage: 32V; Max Output current: 3.5A; Max Output Voltage: 31V; Max Switching Frequency: 450kHz; Min Input Voltage: 3.8V; Min Output Voltage: 800mV; Nominal Supply Voltage: 12V; Nominal Output Voltage: 5V; Number of Circuits: 1; Supplier: Mouser; Supplier Part Number: 621-AP63357DV-7; Manufacturer Part Number: AP63357DV-7; RoHS: Compliant; Category: Voltage Regulators - Switching; Stock: 32903; Pricing: 1=0.86, 10=0.612, 50=0.552, 100=0.485, 1000=0.41, 10000=0.403 (USD); China RoHS: Compliant; Country of Origin: Mainland China; Export Control Classification Number (ECCN) Code: EAR99; Height - Seated (Max): 850µm; Harmonized Tariff Schedule (HTS) Code: 8542.39.00.60; Introduction Date: 2019-08-19; Length: 3mm; Lifecycle Status: Production; Max Operating Temperature: 85°C; Min Operating Temperature: -40°C; Number of Terminals: 9; REACH SVHC: Yes; Terminal Pitch: 450µm; Topology: Buck; Width: 2mm; ComponentLink1URL: https://datasheet.octopart.com:443/AP63357DV-7-Diodes-Inc.-datasheet-145012321.pdf?src-supplier=IHS; ComponentLink1Description: https://datasheet.octopart.com:443/AP63357DV-7-Diodes-Inc.-datasheet-145012321.pdf?src-supplier=IHS; ComponentLink2URL: https://sigma.octopart.com:443/151209837/technical_drawing/Diodes-Inc.-AP63357DV-7.pdf?src-supplier=Diodes+Inc+SCT; ComponentLink2Description: https://sigma.octopart.com:443/151209837/technical_drawing/Diodes-Inc.-AP63357DV-7.pdf?src-supplier=Diodes+Inc+SCT